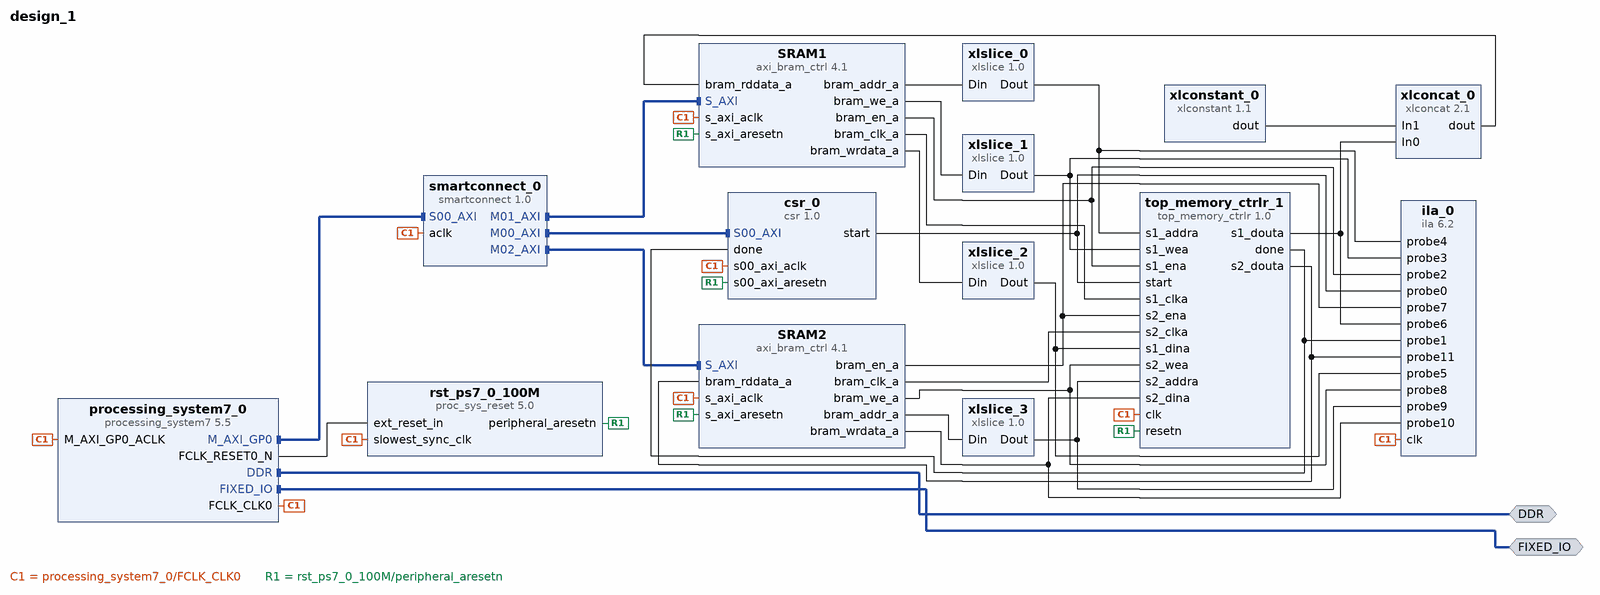
[diagram p0: block diagram of the top level]
# Vivado block design design_1, xc7z020clg400-1, Vivado 2021.1
create_bd_design design_1

create_bd_intf_port -mode Master -vlnv xilinx.com:interface:ddrx_rtl:1.0 DDR
create_bd_intf_port -mode Master -vlnv xilinx.com:display_processing_system7:fixedio_rtl:1.0 FIXED_IO

create_bd_cell -type ip -vlnv xilinx.com:ip:processing_system7:5.5 processing_system7_0
set_property -dict [list \
  CONFIG.PCW_APU_PERIPHERAL_FREQMHZ 650 \
  CONFIG.PCW_CRYSTAL_PERIPHERAL_FREQMHZ 50 \
  CONFIG.PCW_ENET0_ENET0_IO {MIO 16 .. 27} \
  CONFIG.PCW_ENET0_GRP_MDIO_ENABLE 1 \
  CONFIG.PCW_ENET0_GRP_MDIO_IO {MIO 52 .. 53} \
  CONFIG.PCW_ENET0_PERIPHERAL_ENABLE 1 \
  CONFIG.PCW_ENET0_RESET_ENABLE 1 \
  CONFIG.PCW_ENET0_RESET_IO {MIO 9} \
  CONFIG.PCW_ENET_RESET_ENABLE 1 \
  CONFIG.PCW_ENET_RESET_SELECT {Share reset pin} \
  CONFIG.PCW_FPGA0_PERIPHERAL_FREQMHZ 100 \
  CONFIG.PCW_FPGA1_PERIPHERAL_FREQMHZ 50 \
  CONFIG.PCW_GPIO_MIO_GPIO_ENABLE 1 \
  CONFIG.PCW_GPIO_MIO_GPIO_IO MIO \
  CONFIG.PCW_I2C_RESET_ENABLE 1 \
  CONFIG.PCW_M_AXI_GP0_FREQMHZ 10 \
  CONFIG.PCW_PERIPHERAL_BOARD_PRESET None \
  CONFIG.PCW_PRESET_BANK1_VOLTAGE {LVCMOS 1.8V} \
  CONFIG.PCW_QSPI_GRP_FBCLK_ENABLE 1 \
  CONFIG.PCW_QSPI_GRP_FBCLK_IO {MIO 8} \
  CONFIG.PCW_QSPI_GRP_SINGLE_SS_ENABLE 1 \
  CONFIG.PCW_QSPI_GRP_SINGLE_SS_IO {MIO 1 .. 6} \
  CONFIG.PCW_QSPI_PERIPHERAL_ENABLE 1 \
  CONFIG.PCW_QSPI_QSPI_IO {MIO 1 .. 6} \
  CONFIG.PCW_SD0_GRP_CD_ENABLE 1 \
  CONFIG.PCW_SD0_GRP_CD_IO {MIO 47} \
  CONFIG.PCW_SD0_GRP_WP_ENABLE 0 \
  CONFIG.PCW_SD0_PERIPHERAL_ENABLE 1 \
  CONFIG.PCW_SD0_SD0_IO {MIO 40 .. 45} \
  CONFIG.PCW_SDIO_PERIPHERAL_FREQMHZ 50 \
  CONFIG.PCW_SINGLE_QSPI_DATA_MODE x4 \
  CONFIG.PCW_UART0_PERIPHERAL_ENABLE 1 \
  CONFIG.PCW_UART0_UART0_IO {MIO 14 .. 15} \
  CONFIG.PCW_UART1_PERIPHERAL_ENABLE 0 \
  CONFIG.PCW_UART_PERIPHERAL_FREQMHZ 100 \
  CONFIG.PCW_UIPARAM_DDR_BUS_WIDTH {16 Bit} \
  CONFIG.PCW_UIPARAM_DDR_FREQ_MHZ 525 \
  CONFIG.PCW_UIPARAM_DDR_PARTNO {MT41J256M16 RE-125} \
  CONFIG.PCW_USB0_PERIPHERAL_ENABLE 1 \
  CONFIG.PCW_USB0_RESET_ENABLE 1 \
  CONFIG.PCW_USB0_RESET_IO {MIO 46} \
  CONFIG.PCW_USB0_USB0_IO {MIO 28 .. 39} \
  CONFIG.PCW_USB_RESET_ENABLE 1 \
  CONFIG.PCW_USB_RESET_SELECT {Share reset pin} \
] [get_bd_cells processing_system7_0]
# 481 more settings of processing_system7_0 are not shown: defaults, MIO pin electricals, DDR timing, and values the tool derives
create_bd_cell -type ip -vlnv xilinx.com:ip:axi_bram_ctrl:4.1 SRAM1
set_property -dict {CONFIG.SINGLE_PORT_BRAM 1} [get_bd_cells SRAM1]
create_bd_cell -type ip -vlnv xilinx.com:ip:axi_bram_ctrl:4.1 SRAM2
set_property -dict {CONFIG.SINGLE_PORT_BRAM 1} [get_bd_cells SRAM2]
create_bd_cell -type ip -vlnv xilinx.com:ip:xlslice:1.0 xlslice_0
set_property -dict {CONFIG.DIN_FROM 9 CONFIG.DIN_TO 2 CONFIG.DIN_WIDTH 12 CONFIG.DOUT_WIDTH 8} [get_bd_cells xlslice_0]
create_bd_cell -type ip -vlnv xilinx.com:ip:xlslice:1.0 xlslice_1
set_property -dict {CONFIG.DIN_FROM 1 CONFIG.DIN_WIDTH 4 CONFIG.DOUT_WIDTH 2} [get_bd_cells xlslice_1]
create_bd_cell -type ip -vlnv xilinx.com:ip:xlslice:1.0 xlslice_2
set_property -dict {CONFIG.DIN_FROM 15 CONFIG.DOUT_WIDTH 16} [get_bd_cells xlslice_2]
create_bd_cell -type ip -vlnv xilinx.com:ip:xlconstant:1.1 xlconstant_0
set_property -dict {CONFIG.CONST_VAL 0 CONFIG.CONST_WIDTH 16} [get_bd_cells xlconstant_0]
create_bd_cell -type ip -vlnv xilinx.com:ip:xlconcat:2.1 xlconcat_0
set_property -dict {CONFIG.IN0_WIDTH 16 CONFIG.IN1_WIDTH 16} [get_bd_cells xlconcat_0]
create_bd_cell -type ip -vlnv xilinx.com:ip:xlslice:1.0 xlslice_3
set_property -dict {CONFIG.DIN_FROM 9 CONFIG.DIN_TO 2 CONFIG.DIN_WIDTH 12 CONFIG.DOUT_WIDTH 8} [get_bd_cells xlslice_3]
create_bd_cell -type ip -vlnv xilinx.com:ip:smartconnect:1.0 smartconnect_0
set_property -dict {CONFIG.NUM_MI 3 CONFIG.NUM_SI 1} [get_bd_cells smartconnect_0]
create_bd_cell -type ip -vlnv xilinx.com:ip:proc_sys_reset:5.0 rst_ps7_0_100M
create_bd_cell -type ip -vlnv xilinx.com:ip:ila:6.2 ila_0
set_property -dict [list \
  CONFIG.C_ENABLE_ILA_AXI_MON false \
  CONFIG.C_MONITOR_TYPE Native \
  CONFIG.C_NUM_OF_PROBES 12 \
  CONFIG.C_PROBE10_TYPE 1 \
  CONFIG.C_PROBE10_WIDTH 32 \
  CONFIG.C_PROBE11_TYPE 1 \
  CONFIG.C_PROBE11_WIDTH 32 \
  CONFIG.C_PROBE3_TYPE 1 \
  CONFIG.C_PROBE3_WIDTH 2 \
  CONFIG.C_PROBE4_TYPE 1 \
  CONFIG.C_PROBE4_WIDTH 8 \
  CONFIG.C_PROBE5_TYPE 1 \
  CONFIG.C_PROBE5_WIDTH 16 \
  CONFIG.C_PROBE6_TYPE 1 \
  CONFIG.C_PROBE6_WIDTH 16 \
  CONFIG.C_PROBE8_TYPE 1 \
  CONFIG.C_PROBE8_WIDTH 4 \
  CONFIG.C_PROBE9_TYPE 1 \
  CONFIG.C_PROBE9_WIDTH 8 \
] [get_bd_cells ila_0]
create_bd_cell -type ip -vlnv xilinx.com:user:top_memory_ctrlr:1.0 top_memory_ctrlr_1
create_bd_cell -type ip -vlnv xilinx.com:user:csr:1.0 csr_0

# ---- connections ----

connect_bd_intf_net [get_bd_intf_ports DDR] [get_bd_intf_pins processing_system7_0/DDR]
connect_bd_intf_net [get_bd_intf_ports FIXED_IO] [get_bd_intf_pins processing_system7_0/FIXED_IO]
connect_bd_intf_net [get_bd_intf_pins smartconnect_0/S00_AXI] [get_bd_intf_pins processing_system7_0/M_AXI_GP0]
connect_bd_intf_net [get_bd_intf_pins csr_0/S00_AXI] [get_bd_intf_pins smartconnect_0/M00_AXI]
connect_bd_intf_net [get_bd_intf_pins smartconnect_0/M01_AXI] [get_bd_intf_pins SRAM1/S_AXI]
connect_bd_intf_net [get_bd_intf_pins SRAM2/S_AXI] [get_bd_intf_pins smartconnect_0/M02_AXI]
connect_bd_net [get_bd_pins SRAM1/bram_addr_a] [get_bd_pins xlslice_0/Din]
connect_bd_net [get_bd_pins SRAM1/bram_clk_a] [get_bd_pins top_memory_ctrlr_1/s1_clka]
connect_bd_net [get_bd_pins SRAM1/bram_en_a] [get_bd_pins ila_0/probe2] [get_bd_pins top_memory_ctrlr_1/s1_ena]
connect_bd_net [get_bd_pins SRAM1/bram_we_a] [get_bd_pins xlslice_1/Din]
connect_bd_net [get_bd_pins SRAM1/bram_wrdata_a] [get_bd_pins xlslice_2/Din]
connect_bd_net [get_bd_pins SRAM2/bram_addr_a] [get_bd_pins xlslice_3/Din]
connect_bd_net [get_bd_pins SRAM2/bram_clk_a] [get_bd_pins top_memory_ctrlr_1/s2_clka]
connect_bd_net [get_bd_pins SRAM2/bram_en_a] [get_bd_pins ila_0/probe7] [get_bd_pins top_memory_ctrlr_1/s2_ena]
connect_bd_net [get_bd_pins SRAM2/bram_we_a] [get_bd_pins ila_0/probe8] [get_bd_pins top_memory_ctrlr_1/s2_wea]
connect_bd_net [get_bd_pins SRAM2/bram_wrdata_a] [get_bd_pins ila_0/probe10] [get_bd_pins top_memory_ctrlr_1/s2_dina]
connect_bd_net [get_bd_pins csr_0/start] [get_bd_pins ila_0/probe0] [get_bd_pins top_memory_ctrlr_1/start]
connect_bd_net [get_bd_pins processing_system7_0/FCLK_CLK0] \
  [get_bd_pins smartconnect_0/aclk] [get_bd_pins rst_ps7_0_100M/slowest_sync_clk] \
  [get_bd_pins processing_system7_0/M_AXI_GP0_ACLK] [get_bd_pins SRAM1/s_axi_aclk] [get_bd_pins SRAM2/s_axi_aclk] \
  [get_bd_pins ila_0/clk] [get_bd_pins top_memory_ctrlr_1/clk] [get_bd_pins csr_0/s00_axi_aclk]
connect_bd_net [get_bd_pins processing_system7_0/FCLK_RESET0_N] [get_bd_pins rst_ps7_0_100M/ext_reset_in]
connect_bd_net [get_bd_pins rst_ps7_0_100M/peripheral_aresetn] \
  [get_bd_pins SRAM1/s_axi_aresetn] [get_bd_pins SRAM2/s_axi_aresetn] [get_bd_pins top_memory_ctrlr_1/resetn] \
  [get_bd_pins csr_0/s00_axi_aresetn]
connect_bd_net -net top_memory_ctrlr_0_done [get_bd_pins top_memory_ctrlr_1/done] [get_bd_pins ila_0/probe1] [get_bd_pins csr_0/done]
connect_bd_net -net top_memory_ctrlr_0_s1_douta [get_bd_pins top_memory_ctrlr_1/s1_douta] [get_bd_pins xlconcat_0/In0] [get_bd_pins ila_0/probe6]
connect_bd_net -net top_memory_ctrlr_0_s2_douta [get_bd_pins top_memory_ctrlr_1/s2_douta] \
  [get_bd_pins SRAM2/bram_rddata_a] [get_bd_pins ila_0/probe11]
connect_bd_net [get_bd_pins xlconcat_0/dout] [get_bd_pins SRAM1/bram_rddata_a]
connect_bd_net [get_bd_pins xlconstant_0/dout] [get_bd_pins xlconcat_0/In1]
connect_bd_net [get_bd_pins xlslice_0/Dout] [get_bd_pins ila_0/probe4] [get_bd_pins top_memory_ctrlr_1/s1_addra]
connect_bd_net [get_bd_pins xlslice_1/Dout] [get_bd_pins ila_0/probe3] [get_bd_pins top_memory_ctrlr_1/s1_wea]
connect_bd_net [get_bd_pins xlslice_2/Dout] [get_bd_pins ila_0/probe5] [get_bd_pins top_memory_ctrlr_1/s1_dina]
connect_bd_net [get_bd_pins xlslice_3/Dout] [get_bd_pins ila_0/probe9] [get_bd_pins top_memory_ctrlr_1/s2_addra]

# ---- address map ----
assign_bd_address -offset 0x40000000 -range 4K -target_address_space [get_bd_addr_spaces processing_system7_0/Data] [get_bd_addr_segs SRAM1/S_AXI/Mem0]
assign_bd_address -offset 0x42000000 -range 4K -target_address_space [get_bd_addr_spaces processing_system7_0/Data] [get_bd_addr_segs SRAM2/S_AXI/Mem0]
assign_bd_address -offset 0x43C00000 -range 128 -target_address_space [get_bd_addr_spaces processing_system7_0/Data] [get_bd_addr_segs csr_0/S00_AXI/S00_AXI_reg]

validate_bd_design
save_bd_design
